# Altium schematic sheet Controller.SchDoc
size A
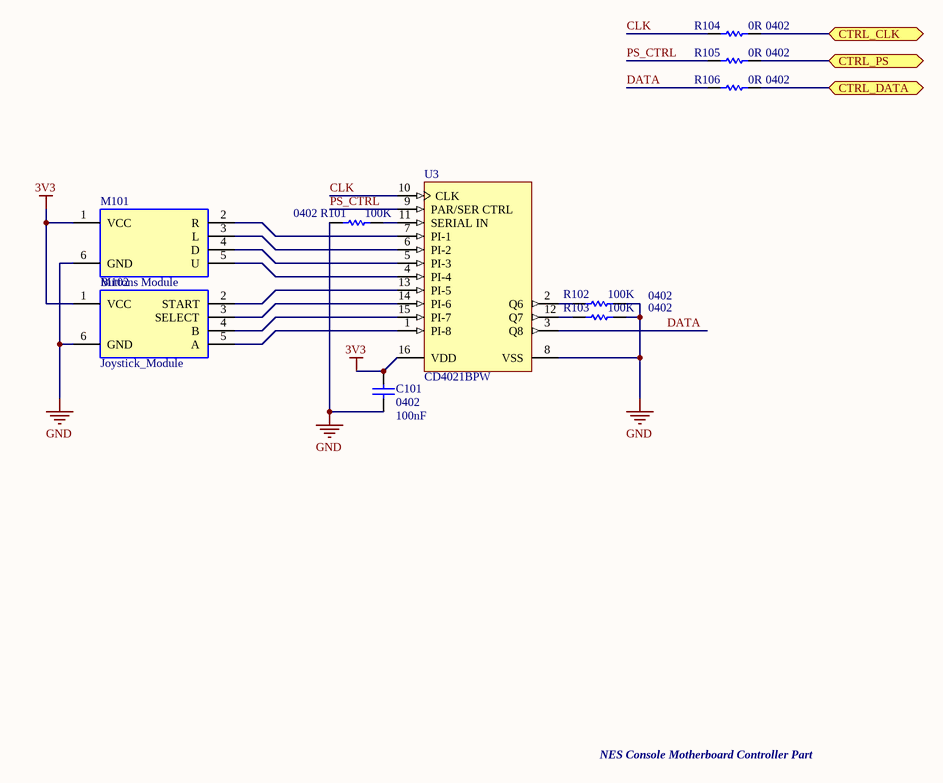
[diagram p0: Controller.SchDoc]

## Parts
C101  0402  value 100nF  [CAPC1005X06N]
M101  Buttons Module  [BUTTON_MODULE]
M102  Joystick_Module  [Joystick_Module]
R101  0402  value 100K  [RESC1005X04N]
R102  0402  value 100K  [RESC1005X04N]
R103  0402  value 100K  [RESC1005X04N]
R104  0402  value 0R  [RESC1005X04N]
R105  0402  value 0R  [RESC1005X04N]
R106  0402  value 0R  [RESC1005X04N]
U3  CD4021BPW  [PW0016A_N]

## Ports
CTRL_CLK (bidir), CTRL_DATA (bidir), CTRL_PS (bidir)

## Nets
3V3: C101.2 M101.1(VCC) M102.1(VCC) U3.16(VDD)
GND: C101.1 M101.6(GND) M102.6(GND) R101.2 R102.1 R103.1 U3.8(VSS)
CLK: R104.2 U3.10(CLK)
CTRL_CLK: R104.1 ; port CTRL_CLK
CTRL_DATA: R106.1 ; port CTRL_DATA
CTRL_PS: R105.1 ; port CTRL_PS
DATA: R106.2 U3.3(Q8)
PS_CTRL: R105.2 U3.9(PAR/SER_CTRL)
NetM101_2: M101.2(R) U3.7(PI-1)
NetM101_3: M101.3(L) U3.6(PI-2)
NetM101_4: M101.4(D) U3.5(PI-3)
NetM101_5: M101.5(U) U3.4(PI-4)
NetM102_2: M102.2(START) U3.13(PI-5)
NetM102_3: M102.3(SELECT) U3.14(PI-6)
NetM102_4: M102.4(B) U3.15(PI-7)
NetM102_5: M102.5(A) U3.1(PI-8)
NetR101_1: R101.1 U3.11(SERIAL_IN)
NetR102_2: R102.2 U3.2(Q6)
NetR103_2: R103.2 U3.12(Q7)

## Notes on the sheet
- NES Console Motherboard Controller Part

## Library data of the parts
C101 = Cap: Capacitor; Published: 8-Jun-2000; LatestRevisionDate: 17-Jul-2002; LatestRevisionNote: Re-released for DXP Platform.; PackageReference: RAD-0.3; Publisher: Altium Limited; PackageDescription: Radial Cap, Thru-Hole; 2 Leads; 0.3 in Pin Spacing
M101 = Buttons Module: Controller Buttons Module
M102 = Joystick Module: Controller Joystick module
R101-R106 = Res1: Resistor; Published: 8-Jun-2000; LatestRevisionDate: 17-Jul-2002; LatestRevisionNote: Re-released for DXP Platform.; PackageReference: AXIAL-0.3; Publisher: Altium Limited; PackageDescription: Axial Device, Thru-Hole; 2 Leads; 0.3 in Pin Spacing
U3 = CD4021BPW: CMOS 8-Stage Static Shift Register, PW0016A, TUBE; Manufacturer: Texas Instruments; Technology Family: CD4000; VCC(Min)(V): 3; VCC(Max)(V): 18; Voltage(Nom)(V): 10; F @ Nom Voltage(Max)(Mhz): 8; ICC @ Nom Voltage(Max)(mA): 0.3; tpd @ Nom Voltage(Max)(ns): 160; Output Drive (IOL/IOH)(Max)(mA): 1.5/-1.5; 3-State Output: No; Rating: Military; Bits: 4; DatasheetVersion: SCHS024C; PackageReference: PW0016A; Generic Part Number: CD4021B; Input Type: CMOS; Output Type: CMOS; Operating Temperature Range(C): -55 to 125; Code_JEDEC: MO-153; PartNumber: CD4021BPW; ComponentLink1Description: Manufacturer URL; ComponentLink1URL: http://www.ti.com/; ComponentLink2Description: Datasheet; ComponentLink2URL: http://www.ti.com/lit/ds/symlink/cd4021b.pdf; ComponentLink3Description: Package Specification; ComponentLink3URL: http://www.ti.com/lit/ml/mpds361/mpds361.pdf